# Altium schematic sheet system.SchDoc
size A4
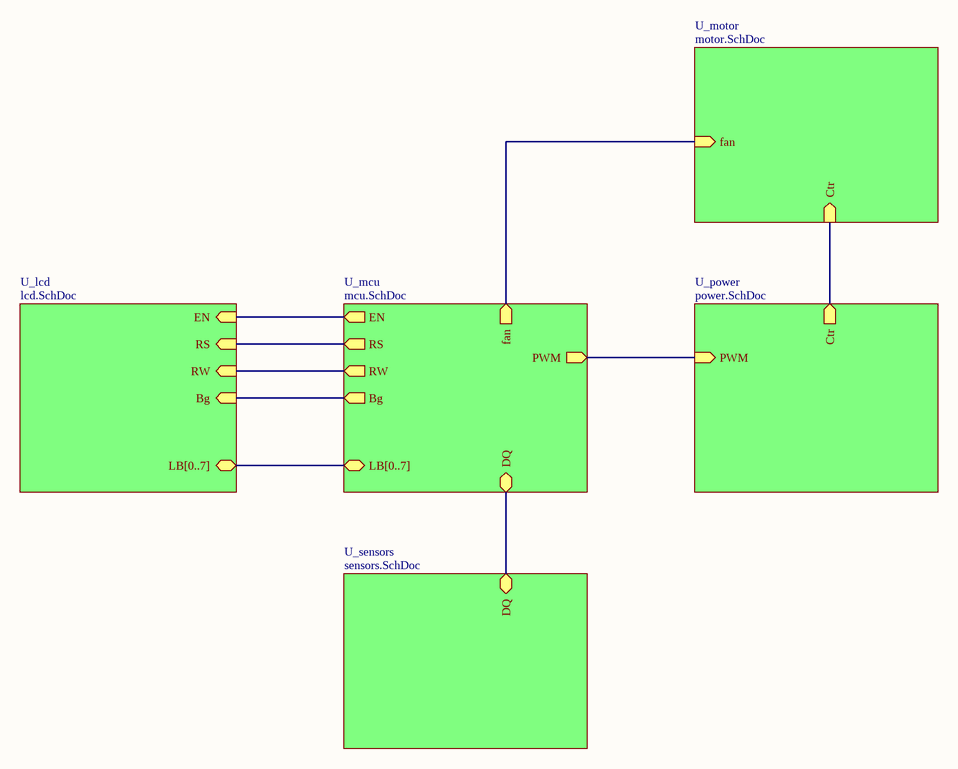
[diagram p0: system.SchDoc]

## Sub-sheets
U_lcd = lcd.SchDoc: Bg (in), RS (in), RW (in), EN (in), LB[0..7] (bidir)
U_mcu = mcu.SchDoc: RS (out), RW (out), EN (out), PWM (out), Bg (out), LB[0..7] (bidir), fan (out), DQ (bidir)
U_motor = motor.SchDoc: Ctr (in), fan (in)
U_power = power.SchDoc: PWM (in), Ctr (out)
U_sensors = sensors.SchDoc: DQ (bidir)

## Nets
(unnamed): sheet U_mcu/RS, sheet U_lcd/RS
(unnamed): sheet U_mcu/RW, sheet U_lcd/RW
(unnamed): sheet U_mcu/EN, sheet U_lcd/EN
(unnamed): sheet U_mcu/PWM, sheet U_power/PWM
(unnamed): sheet U_mcu/Bg, sheet U_lcd/Bg
(unnamed): sheet U_mcu/fan, sheet U_motor/fan
(unnamed): sheet U_mcu/DQ, sheet U_sensors/DQ
(unnamed): sheet U_motor/Ctr, sheet U_power/Ctr

## Buses and harness runs
bus sheet U_lcd/LB[0..7] = sheet U_mcu/LB[0..7]